# EAGLE design 1LD-20-mk-1.0.1 (EAGLE 9.3.1)
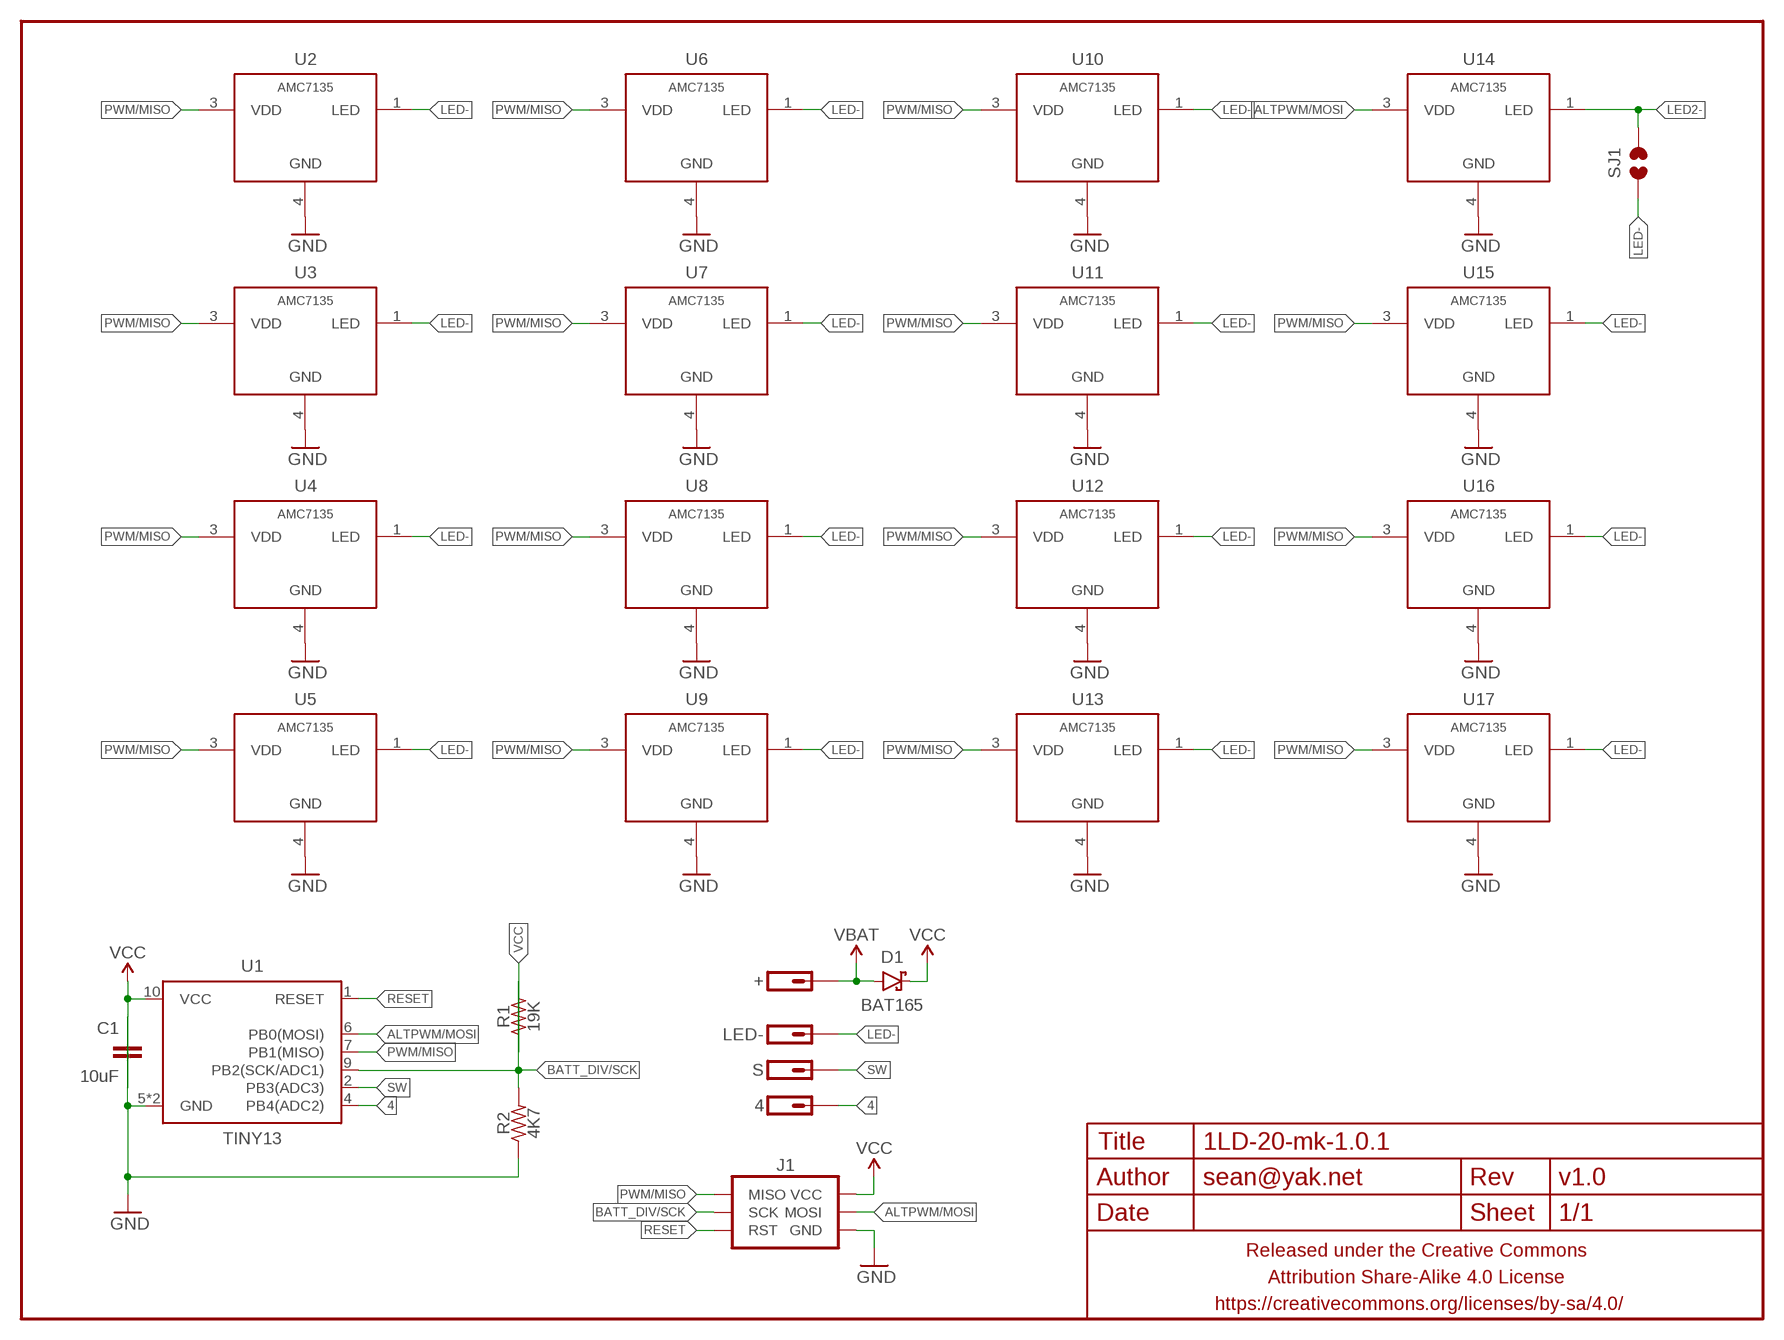
[diagram p0: schematic, sheet 1]

## Parts
4  M01SMD-1MM-DIA-NS  [1X01-SMD-1MM-DIA-NS]
+  M01PTH-1.4MM  [1X01-1.4MM-CIR]
C1  10uF  CAPACITOR-CERAMICC0402  [C0402]
D1  BAT165  DIODE-SCHOTTKYSOD323  [SOD323-SCHOTTKY]
FRAME1  FRAME-LETTERNO_PACKAGE  [DUMMY]
J1  AVR_SPI_PRG_6SMD-1.27MM  [2X3-1.27MM-SMD]
LED-  M01PTH-1MM-CIR-NS  [1X01-1MM-CIR-NS]
R1  19K  RESISTORR0402  [R0402]
R2  4K7  RESISTORR0402  [R0402]
S  M01SMD-1MM-DIA-NS  [1X01-SMD-1MM-DIA-NS]
SJ1  JUMPER-PAD-2-NOSMOL_NS  [PAD-JUMPER-2-NO_SMOL_NS]
U1  TINY13  ATTINY1310M1  [QFN10(2X5)]
U2  AMC7135  AMC7135ROUNDED-LESS  [SOT89-NOTHERM-ROUNDED-LESS]
U3  AMC7135  AMC7135ROUNDED-LESS  [SOT89-NOTHERM-ROUNDED-LESS]
U4  AMC7135  AMC7135ROUNDED-LESS  [SOT89-NOTHERM-ROUNDED-LESS]
U5  AMC7135  AMC7135ROUNDED-LESS  [SOT89-NOTHERM-ROUNDED-LESS]
U6  AMC7135  AMC7135ROUNDED-LESS  [SOT89-NOTHERM-ROUNDED-LESS]
U7  AMC7135  AMC7135ROUNDED-LESS  [SOT89-NOTHERM-ROUNDED-LESS]
U8  AMC7135  AMC7135ROUNDED-LESS  [SOT89-NOTHERM-ROUNDED-LESS]
U9  AMC7135  AMC7135ROUNDED-LESS  [SOT89-NOTHERM-ROUNDED-LESS]
U10  AMC7135  AMC7135ROUNDED-LESS  [SOT89-NOTHERM-ROUNDED-LESS]
U11  AMC7135  AMC7135ROUNDED-LESS  [SOT89-NOTHERM-ROUNDED-LESS]
U12  AMC7135  AMC7135ROUNDED-LESS  [SOT89-NOTHERM-ROUNDED-LESS]
U13  AMC7135  AMC7135ROUNDED-LESS  [SOT89-NOTHERM-ROUNDED-LESS]
U14  AMC7135  AMC7135ROUNDED-LESS  [SOT89-NOTHERM-ROUNDED-LESS]
U15  AMC7135  AMC7135ROUNDED-LESS  [SOT89-NOTHERM-ROUNDED-LESS]
U16  AMC7135  AMC7135ROUNDED-LESS  [SOT89-NOTHERM-ROUNDED-LESS]
U17  AMC7135  AMC7135ROUNDED-LESS  [SOT89-NOTHERM-ROUNDED-LESS]

## Nets
4: 4.P$1 U1.4(PB4(ADC2))
ALTPWM/MOSI: J1.4(MOSI) U1.6(PB0(MOSI)) U14.3(VDD)
BATT_DIV/SCK: J1.3(SCK) R1.2 R2.2 U1.9(PB2(SCK/ADC1))
GND: C1.1 J1.6(GND) R2.1 U1.5(GND) U1.PAD(GND) U2.4(GND) U3.4(GND) U4.4(GND) U5.4(GND) U6.4(GND) U7.4(GND) U8.4(GND) U9.4(GND) U10.4(GND) U11.4(GND) U12.4(GND) U13.4(GND) U14.4(GND) U15.4(GND) U16.4(GND) U17.4(GND)
LED2-: SJ1.2 U14.1(LED)
LED-: LED-.1 SJ1.1 U2.1(LED) U3.1(LED) U4.1(LED) U5.1(LED) U6.1(LED) U7.1(LED) U8.1(LED) U9.1(LED) U10.1(LED) U11.1(LED) U12.1(LED) U13.1(LED) U15.1(LED) U16.1(LED) U17.1(LED)
PWM/MISO: J1.1(MISO) U1.7(PB1(MISO)) U2.3(VDD) U3.3(VDD) U4.3(VDD) U5.3(VDD) U6.3(VDD) U7.3(VDD) U8.3(VDD) U9.3(VDD) U10.3(VDD) U11.3(VDD) U12.3(VDD) U13.3(VDD) U15.3(VDD) U16.3(VDD) U17.3(VDD)
RESET: J1.5(RST) U1.1(RESET)
SW: S.P$1 U1.2(PB3(ADC3))
VBAT: +.P$1 D1.A
VCC: C1.2 D1.C J1.2(VCC) R1.1 U1.10(VCC)

## Library data of the parts
4 + LED- S = a_parts:M01: Header 1 Standard 1-pin 0.1" header. Use with straight break away headers (SKU : PRT-00116), right angle break away headers (PRT-00553), swiss pins (PRT-00743), machine pins (PRT-00117), and female headers (PRT-00115).
C1 = a_parts:CAPACITOR-CERAMIC: CAPACITOR, European symbol
D1 = a_parts:DIODE-SCHOTTKY: Schottky diodes in SFE's production catalog BAT20J 1A 23V 0.62Vf RB751 120mA 40V 0.37Vf PMEG4005EJ 0.5A 40V 0.42Vf MBRA140 1A 40V 0.5Vf B340A 3A 40V SMA
FRAME1 = a_parts:FRAME-LETTER: Schematic Frame Standard 8.5x11 US Letter frame; DESIGNER: sean@yak.net; VERSION: v1.0
J1 = a_parts:AVR_SPI_PRG_6: AVR ISP 6 Pin This is the reduced ISP connector for AVR programming. Common on Arduino. This footprint will take up less PCB space and can be used with a 10-pin to 6-pin adapter such as SKU: BOB-08508 **Special note about "TEST_POINT" package. The stop mask is on the top side, so if you want your programming test points to be on the bottom of your board, make sure to place this package on the bottom side of the board. This also ensure that the orientation to program from the bottom side will be correct.
R1 R2 = a_parts:RESISTOR: RESISTOR, American symbol
SJ1 = a_parts:JUMPER-PAD-2-NO
U1 = a_parts:ATTINY13: Atmel 8-pin 1kB flash uC
U2-U17 = a_parts:AMC7135

## Board
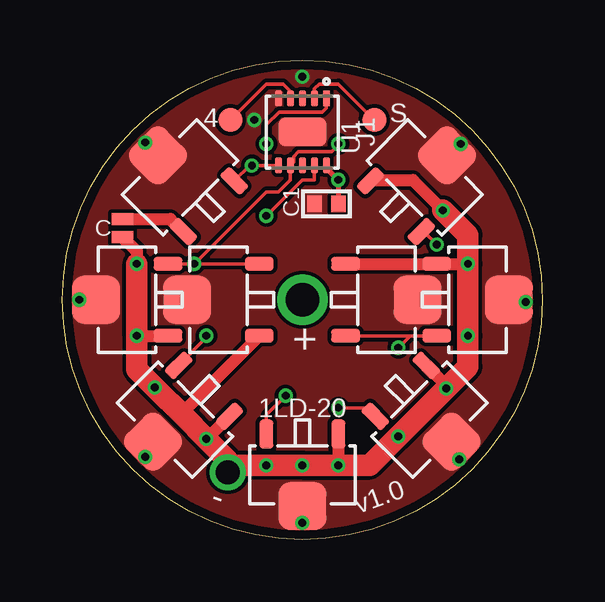
[diagram p1: board, top side]
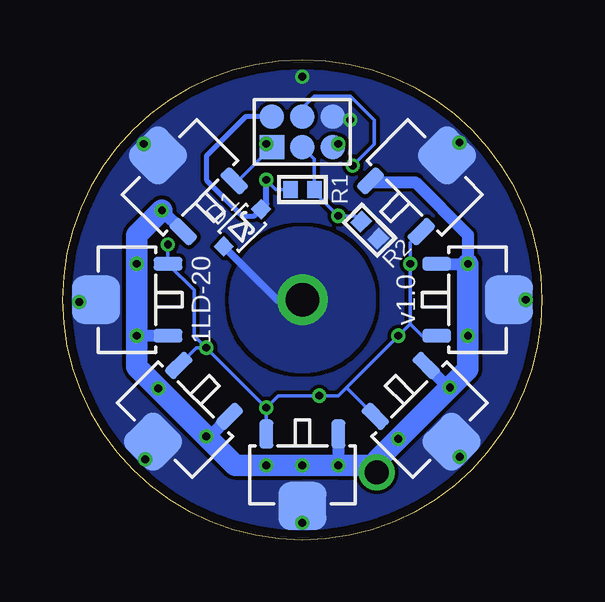
[diagram p2: board, bottom side, seen from below]

Size 20 x 20 mm. Coordinates in mm from the lower left corner, seen from the top.
Outline: 0,10 arc-180 20,10 arc-180 0,10
Copper layers (1*16): Top 0.035559375mm / dielectric 1.6mm / Bottom 0.035559375mm
Design rules "oshpark-2layer": minimum track width 6mil, minimum drill 10mil, track to track 6mil, track to pad 6mil, pad to pad 6mil, via to via 6mil, smd to smd 0mil, copper to edge 15mil, drill to drill 6mil, minimum pad ring 5mil, minimum via ring 5mil, stop-mask expansion 2.5mil, vias tented up to drill 20mil, thermal gap 10mil

### Footprints (pad centres in the part's own frame; a part is rotated, then mirrored left to right if it is on the bottom)
1X01-SMD-1MM-DIA-NS = smd 1 x 1: P$1 0,0
1X01-1.4MM-CIR = drill 1.4 pad 2.1: P$1 0,0
C0402 = smd 0.6 x 0.7: 1 -0.5,0; 2 0.5,0
SOD323-SCHOTTKY = smd 0.6 x 0.6: A -1.1,0; C 1.1,0
2X3-1.27MM-SMD = smd 1.016 x 1.016: 1 -1.27,-0.635; 2 -1.27,0.635; 3 0,-0.635; 4 0,0.635; 5 1.27,-0.635; 6 1.27,0.635
1X01-1MM-CIR-NS = drill 1: 1 0,0
R0402 = smd 0.6 x 0.7: 1 -0.5,0; 2 0.5,0
PAD-JUMPER-2-NO_SMOL_NS = smd 0.5 x 0.9: 1 -0.375,0; 2 0.375,0
QFN10(2X5) = smd 0.65 x 0.28: 1 -1.4,1; 2 -1.4,0.5; 3 -1.4,0; 4 -1.4,-0.5; 5 -1.4,-1; 6 1.4,-1; 7 1.4,-0.5; 8 1.4,0; 9 1.4,0.5; 10 1.4,1 | smd 1.2 x 2: PAD 0,0
SOT89-NOTHERM-ROUNDED-LESS = smd 0.58 x 1.2: 1 -1.5,-1.7; 3 1.5,-1.7 | smd 2 x 2: 4 0,1.3

### Placement (x,y rotation side)
4  7,17.5 90 top
+  10,10 90 top
C1  11,14 0 top
D1  12.5,13 45 bottom
FRAME1  0,0 0 top
J1  10,17 0 bottom
LED-  6.9,2.8 270 top
R1  10,14.6 0 bottom
R2  7.2,12.9 135 bottom
S  13,17.5 0 top
SJ1  2.5,13 90 top
U1  10,17 270 top
U2  15.1,15.1 45 bottom
U3  4.7,5 135 top
U4  10,2.7 180 top
U5  15.3,5 225 top
U6  17.3,10 270 top
U7  6.5,10 90 top
U8  15.1,15.1 315 top
U9  17.3,10 90 bottom
U10  15.3,5 135 bottom
U11  10,2.7 180 bottom
U12  4.7,5 225 bottom
U13  2.7,10 270 bottom
U14  4.9,15.1 45 top
U15  2.7,10 90 top
U16  4.9,15.1 315 bottom
U17  13.5,10 270 top

### Tracks (layer width: path | path; a pad name or v marks a point on that pad's centre or on a via)
4
  Top 0.152: U1.4 9.5,18.7 9.2,19 8.5,19 4.P$1
ALTPWM/MOSI  (via drill 0.33)
  Top 0.152: U1.6 v7.9,15.6 7.8,15.6 U14.3
  Bottom 0.152: J1.4 10,18 9.5,18.5 8,18.5 7,17.5 7,16.5 v7.9,15.6
BATT_DIV/SCK  (via drill 0.33)
  Top 0.152: U1.9 10.5,15 10,15 v8.5,13.5
  Bottom 0.152: J1.3 9.5,15.87 R1.2 9.5,14.5 v8.5,13.5 7.8,13.5 R2.2
GND  (via drill 0.33)
  other vias: 0.7,10 3.45,16.56 10,19.3 16.6,16.5 19.3,9.9 16.54,3.35 10,0.7 3.45,3.45 8,17.5
  pour Top (isolate 0.152, rank 6, no thermals): 0,10 arc90 10,0 arc90 20,10 arc90 10,20 arc90
  pour Bottom (isolate 0.152, rank 6, no thermals): 20,10 arc-90 10,0 arc-90 0,10 arc-90 10,20 arc-90
LED2-
  Top 0.5: SJ1.2 4.5,13.38 U14.1
LED-  (via drill 0.33)
  Top 0.5: v3.1,8.5 U15.1 | U8.1 12.88,15 14.6,15 15.85,13.75 v15.85,13.73 | U3.1 6.02,4.2 v6,4.2 | U4.1 v11.5,3.1 | SJ1.1 3.1,12.03 v3.1,11.5 | U17.1 U6.1 | U7.1 5.05,5.35 5.05,5.15
  Top 0.508: U5.1 16,6.42 v16,6.3 | U6.1 v16.9,11.5
  Top 0.9: v3.1,11.5 v3.1,8.5 3.1,7.1 v3.85,6.35 5.05,5.15 v6,4.2 6.9,3.3 LED-.1 7.2,3.1 v8.5,3.1 v10,3.1 v11.5,3.1 12.8,3.1 v14,4.3 v16,6.3 16.9,7.2 v16.9,8.5 v16.9,11.5 16.9,12.7 15.85,13.75
  Bottom 0.5: U11.1 v8.5,3.1 | U10.1 13.93,4.25 13.95,4.25 | U16.1 7.1,14.9 5.3,14.9 3.1,12.7 v3.1,11.5 U13.1 | U9.1 v16.9,8.5 | U2.1 v15.85,13.73 15.85,13.75 | U12.1 3.93,6.35 v3.85,6.35
  Bottom 0.9: 15.85,13.75 16.9,12.7 v16.9,11.5 v16.9,8.5 16.9,7.2 v16,6.3 13.95,4.25 12.8,3.1 v10,3.1 v8.5,3.1 7.2,3.1 LED-.1 6.9,3.3 v3.85,6.35 3.1,7.1 v3.1,8.5 v3.1,11.5
PWM/MISO  (via drill 0.33)
  Top 0.152: v5.5,11.5 8.5,14.5 9,14.5 9.5,15 U1.7 9.63,15.73 9.63,15.98 9.82,16.17 11.22,16.17 11.5,16.45 v11.5,16.5 | U15.3 v5.5,11.5 | U5.3 12.68,5.5 v11.5,5.5 | U3.3 6,8.42 v6,8.5 | U4.3 8.5,5.2 v9.3,6 | U6.3 14.5,8.5 | 14.5,8.5 v14,8 | v15.6,12.3 15.06,12.84 U8.3 | U7.3 v5.5,11.5 | U17.3 14.5,8.5
  Bottom 0.152: U2.3 12.68,14.96 J1.1 11.4,16.5 v11.5,16.5 | U16.3 5.5,12.38 v5.5,11.5 5.5,9 | U13.3 5,8.5 5.5,9 | 5.5,9 v6,8.5 8.15,6.35 | 8.15,6.35 8.5,6 v9.3,6 11,6 v11.5,5.5 | U12.3 8.15,6.33 8.15,6.35 | v14,8 v11.5,5.5 | U11.3 v11.5,5.5 | U10.3 14.42,8 v14,8 | v14,8 14.5,8.5 14.5,10.4 U9.3 v15.6,12.3
RESET  (via drill 0.33)
  Top 0.152: U1.1 11,18 10.83,17.83 9.03,17.83 8.5,17.3 v8.5,16.5
  Bottom 0.152: v8.5,16.5 8.63,16.36 J1.5
SW
  Top 0.152: U1.2 10.5,18.8 10.7,19 11.5,19 S.P$1
VBAT
  Bottom 0.305: +.P$1 11.06,10 D1.A
  pour Bottom (isolate 0.152, no thermals): 7,10 arc-180 13,10 arc-180
VCC  (via drill 0.33)
  Top 0.2: U1.10 11,15.5 v11.5,15 C1.2
  Bottom 0.152: v11.5,15 11.1,14.6 R1.1
  Bottom 0.2: J1.2 12.37,17.64 14,16 14,15 12.5,13.5 12,13.5 D1.C
  Bottom 0.254: D1.C C1.2 v11.5,15

### Text on the board
tPlace: C | 1LD-20
bPlace: 1LD-20
tNames: -